# EAGLE design BBB_GenericCape (EAGLE 6.5.0)
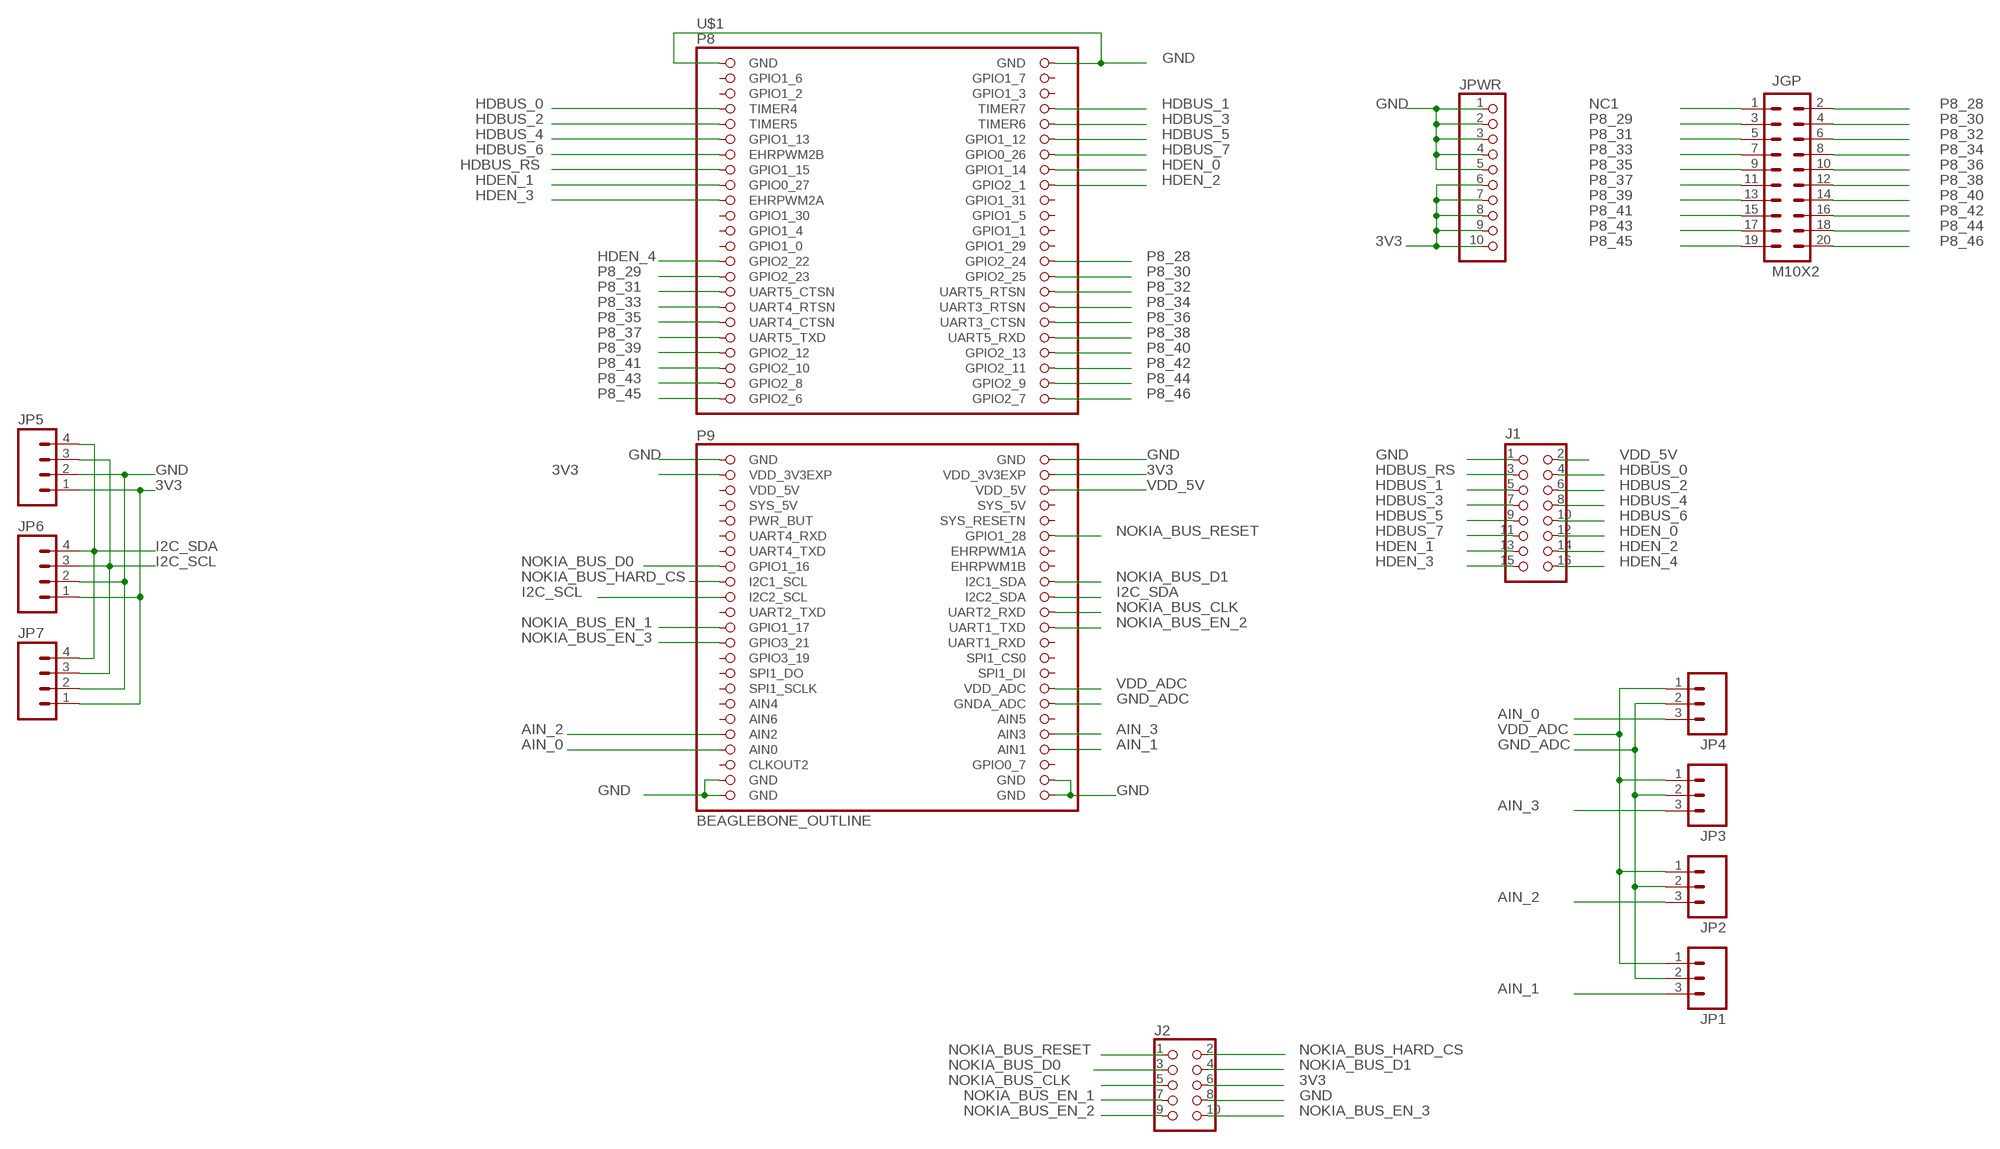
[diagram p0: schematic, sheet 1]

## Parts
J1  CON_HEADER_2X08SHROUDED  [PINSHRD_PTH_2X08]
J2  CON_HEADER_2X05-PTH+SHROUDED_A  [PINSHRD_PTH_2X05]
JGP  M10X2  [2X10]
JP1  M03POLAR  [MOLEX-1X3]
JP2  M03POLAR  [MOLEX-1X3]
JP3  M03POLAR  [MOLEX-1X3]
JP4  M03POLAR  [MOLEX-1X3]
JP5  M04POLAR  [MOLEX-1X4]
JP6  M04POLAR  [MOLEX-1X4]
JP7  M04POLAR  [MOLEX-1X4]
JPWR  PINHD-1X10  [1X10]
U$1  BEAGLEBONE_OUTLINE  [BEAGLEBONE_SHIELD]

## Nets
3V3: J2.6 JP5.1 JP6.1 JP7.1 JPWR.6 JPWR.7 JPWR.8 JPWR.9 JPWR.10 U$1.49(VDD_3V3EXP) U$1.50(VDD_3V3EXP)
AIN_0: JP4.3 U$1.85(AIN0)
AIN_1: JP1.3 U$1.86(AIN1)
AIN_2: JP2.3 U$1.83(AIN2)
AIN_3: JP3.3 U$1.84(AIN3)
GND: J1.1 J2.8 JP5.2 JP6.2 JP7.2 JPWR.1 JPWR.2 JPWR.3 JPWR.4 JPWR.5 U$1.1(GND) U$1.2(GND) U$1.47(GND) U$1.48(GND) U$1.89(GND) U$1.90(GND) U$1.91(GND) U$1.92(GND)
GND_ADC: JP1.2 JP2.2 JP3.2 JP4.2 U$1.80(GNDA_ADC)
HDBUS_0: J1.4 U$1.7(TIMER4)
HDBUS_1: J1.5 U$1.8(TIMER7)
HDBUS_2: J1.6 U$1.9(TIMER5)
HDBUS_3: J1.7 U$1.10(TIMER6)
HDBUS_4: J1.8 U$1.11(GPIO1_13)
HDBUS_5: J1.9 U$1.12(GPIO1_12)
HDBUS_6: J1.10 U$1.13(EHRPWM2B)
HDBUS_7: J1.11 U$1.14(GPIO0_26)
HDBUS_RS: J1.3 U$1.15(GPIO1_15)
HDEN_0: J1.12 U$1.16(GPIO1_14)
HDEN_1: J1.13 U$1.17(GPIO0_27)
HDEN_2: J1.14 U$1.18(GPIO2_1)
HDEN_3: J1.15 U$1.19(EHRPWM2A)
HDEN_4: J1.16 U$1.27(GPIO2_22)
I2C_SCL: JP5.3 JP6.3 JP7.3 U$1.65(I2C2_SCL)
I2C_SDA: JP5.4 JP6.4 JP7.4 U$1.66(I2C2_SDA)
NC1: JGP.1
NOKIA_BUS_CLK: J2.5 U$1.68(UART2_RXD)
NOKIA_BUS_D0: J2.3 U$1.61(GPIO1_16)
NOKIA_BUS_D1: J2.4 U$1.64(I2C1_SDA)
NOKIA_BUS_EN_1: J2.7 U$1.69(GPIO1_17)
NOKIA_BUS_EN_2: J2.9 U$1.70(UART1_TXD)
NOKIA_BUS_EN_3: J2.10 U$1.71(GPIO3_21)
NOKIA_BUS_HARD_CS: J2.2 U$1.63(I2C1_SCL)
NOKIA_BUS_RESET: J2.1 U$1.58(GPIO1_28)
P8_28: JGP.2 U$1.28(GPIO2_24)
P8_29: JGP.3 U$1.29(GPIO2_23)
P8_30: JGP.4 U$1.30(GPIO2_25)
P8_31: JGP.5 U$1.31(UART5_CTSN)
P8_32: JGP.6 U$1.32(UART5_RTSN)
P8_33: JGP.7 U$1.33(UART4_RTSN)
P8_34: JGP.8 U$1.34(UART3_RTSN)
P8_35: JGP.9 U$1.35(UART4_CTSN)
P8_36: JGP.10 U$1.36(UART3_CTSN)
P8_37: JGP.11 U$1.37(UART5_TXD)
P8_38: JGP.12 U$1.38(UART5_RXD)
P8_39: JGP.13 U$1.39(GPIO2_12)
P8_40: JGP.14 U$1.40(GPIO2_13)
P8_41: JGP.15 U$1.41(GPIO2_10)
P8_42: JGP.16 U$1.42(GPIO2_11)
P8_43: JGP.17 U$1.43(GPIO2_8)
P8_44: JGP.18 U$1.44(GPIO2_9)
P8_45: JGP.19 U$1.45(GPIO2_6)
P8_46: JGP.20 U$1.46(GPIO2_7)
VDD_5V: J1.2 U$1.52(VDD_5V)
VDD_ADC: JP1.1 JP2.1 JP3.1 JP4.1 U$1.78(VDD_ADC)
Unconnected: U$1.3(GPIO1_6) U$1.4(GPIO1_7) U$1.5(GPIO1_2) U$1.6(GPIO1_3) U$1.20(GPIO1_31) U$1.21(GPIO1_30) U$1.22(GPIO1_5) U$1.23(GPIO1_4) U$1.24(GPIO1_1) U$1.25(GPIO1_0) U$1.26(GPIO1_29) U$1.54(SYS_5V) U$1.55(PWR_BUT) U$1.56(SYS_RESETN) U$1.57(UART4_RXD) U$1.59(UART4_TXD) U$1.60(EHRPWM1A) U$1.62(EHRPWM1B) U$1.67(UART2_TXD) U$1.72(UART1_RXD) U$1.73(GPIO3_19) U$1.74(SPI1_CS0) U$1.75(SPI1_DO) U$1.76(SPI1_DI) U$1.77(SPI1_SCLK) U$1.79(AIN4) U$1.81(AIN6) U$1.82(AIN5) U$1.87(CLKOUT2) U$1.88(GPIO0_7)

## Power pins joined to a net without a drawn wire
SYS_5V: U$1.53(SYS_5V)
VDD_5V: U$1.51(VDD_5V)

## Library data of the parts
J1 = dp_devices:CON_HEADER_2X08
J2 = dp_devices:CON_HEADER_2X05: 2x05 pin header
JGP = SparkFun-Connectors:M10X2: This was SPECIALLY designed to be used with our Graphic LCD Backpack. Be sure you want to use this! It is not only staggered on each line of header holes, but IT IS ALSO offset of the center point of the top and bottom lines by 5 mil. This causes the headers to lock into place on the "standard" footprint on the LCD screen. The extra squares on the tdocu layer are there simply to reference other pins (if you were to actually populate a longer header than ten long - this is what we do with the backpacks).
JP1-JP4 = SparkFun-Connectors:M03: Header 3 Standard 3-pin 0.1" header. Use with straight break away headers (SKU : PRT-00116), right angle break away headers (PRT-00553), swiss pins (PRT-00743), machine pins (PRT-00117), and female headers (PRT-00115). Molex polarized connector foot print use with SKU : PRT-08232 with associated crimp pins and housings.
JP5-JP7 = SparkFun-Connectors:M04: Header 4 Standard 4-pin 0.1" header. Use with straight break away headers (SKU : PRT-00116), right angle break away headers (PRT-00553), swiss pins (PRT-00743), machine pins (PRT-00117), and female headers (PRT-00115). Molex polarized connector foot print use with SKU : PRT-08231 with associated crimp pins and housings. 1MM SMD Version SKU: PRT-10208
JPWR = pinhead:PINHD-1X10: PIN HEADER
U$1 = adafruit:BEAGLEBONE_OUTLINE: Should match A3 pinout - but not completely tested

## Board
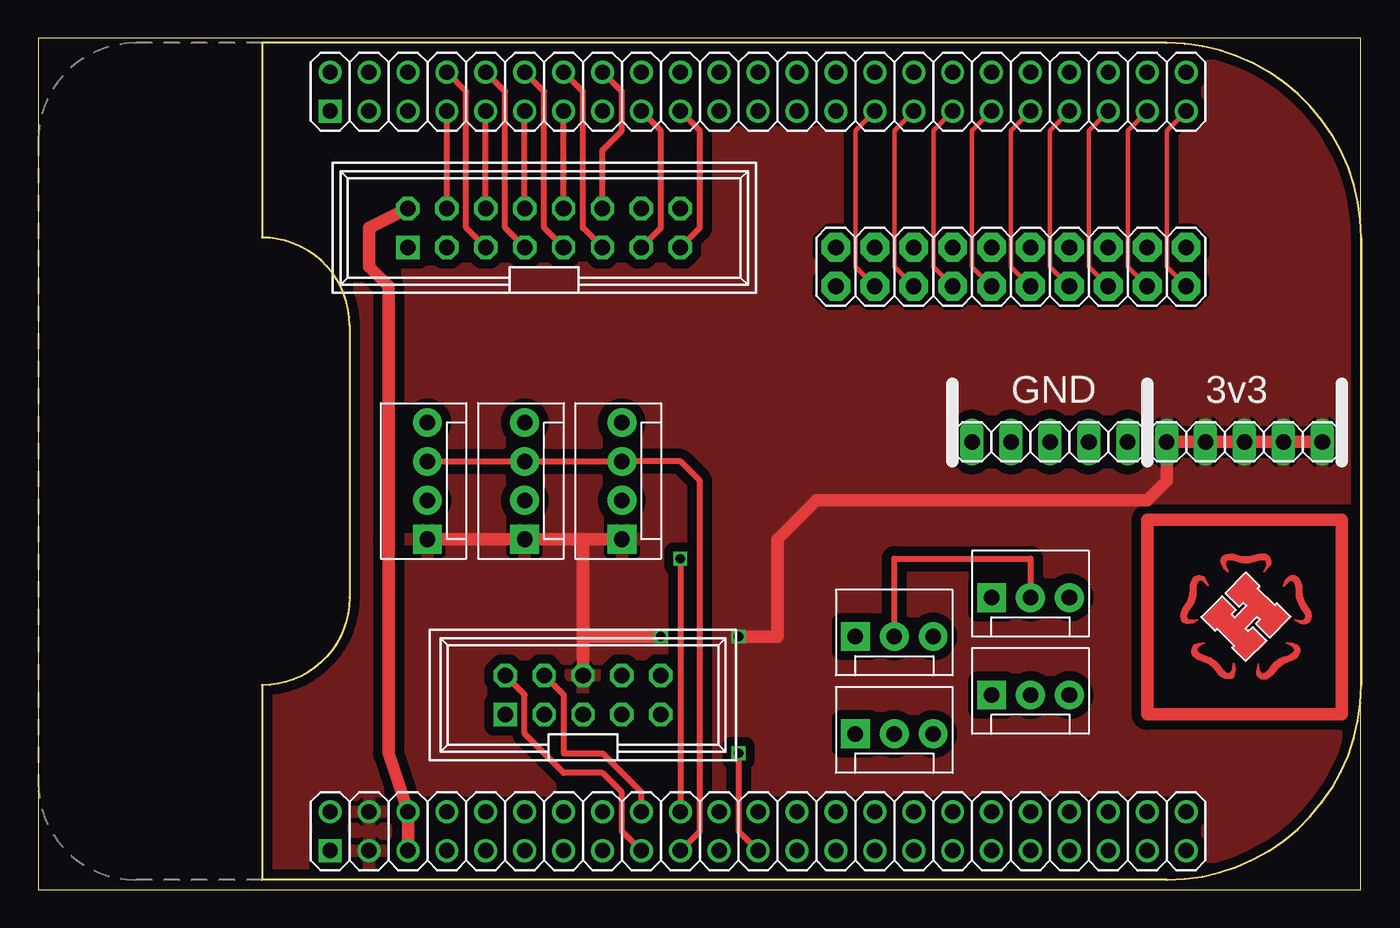
[diagram p1: board, top side]
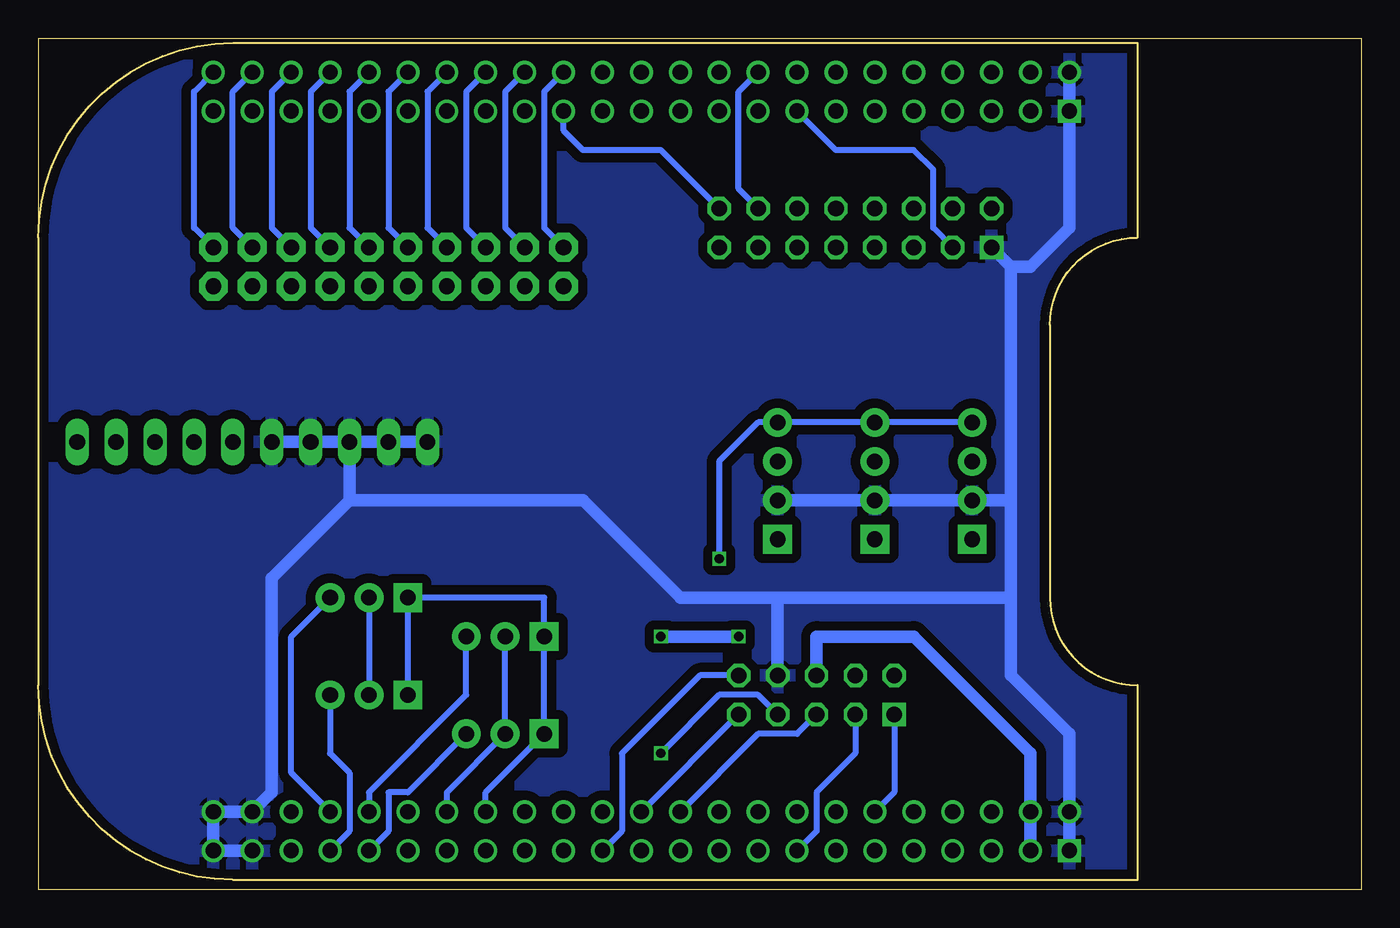
[diagram p2: board, bottom side, seen from below]

Size 86.36 x 55.55 mm. Coordinates in mm from the lower left corner, seen from the top.
Outline: 0,0 86.34,0 86.34,55.55 0,55.55 0,0
Copper layers (1*2*15*16): Top 0.035mm / dielectric 0.2mm / Route2 0.0175mm / dielectric 1.1mm / Route15 0.0175mm / dielectric 0.2mm / Bottom 0.035mm
Design rules "SeeedStudio_DRU_no_angle_20130527": minimum track width 6mil, minimum drill 12mil, track to track 6mil, track to pad 6mil, pad to pad 6mil, via to via 6mil, smd to smd 0mil, copper to edge 10mil, drill to drill 10mil, minimum pad ring 6mil, minimum via ring 6mil, stop-mask expansion 2mil, vias tented up to drill 25mil, thermal gap 10mil

### Footprints (pad centres in the part's own frame; a part is rotated, then mirrored left to right if it is on the bottom)
PINSHRD_PTH_2X08 = drill 1.016 square: 1 -7.62,-1.27 | drill 1.016 octagon: 2 -7.62,1.27; 3 -5.08,-1.27; 4 -5.08,1.27; 5 -2.54,-1.27; 6 -2.54,1.27; 7 0,-1.27; 8 0,1.27; 9 2.54,-1.27; 10 2.54,1.27; 11 5.08,-1.27; 12 5.08,1.27; 13 7.62,-1.27; 14 7.62,1.27; 15 10.16,-1.27; 16 10.16,1.27
PINSHRD_PTH_2X05 = drill 1.016 square: 1 -5.08,-1.27 | drill 1.016 octagon: 2 -5.08,1.27; 3 -2.54,-1.27; 4 -2.54,1.27; 5 0,-1.27; 6 0,1.27; 7 2.54,-1.27; 8 2.54,1.27; 9 5.08,-1.27; 10 5.08,1.27
2X10 = drill 1.016 pad 1.88 octagon: 1 -11.43,-1.27; 2 -11.43,1.27; 3 -8.89,-1.27; 4 -8.89,1.27; 5 -6.35,-1.27; 6 -6.35,1.27; 7 -3.81,-1.27; 8 -3.81,1.27; 9 -1.27,-1.27; 10 -1.27,1.27; 11 1.27,-1.27; 12 1.27,1.27; 13 3.81,-1.27; 14 3.81,1.27; 15 6.35,-1.27; 16 6.35,1.27; 17 8.89,-1.27; 18 8.89,1.27; 19 11.43,-1.27; 20 11.43,1.27
MOLEX-1X3 = drill 1.016 pad 1.88 square: 1 0,0 | drill 1.016 pad 1.88: 2 2.54,0; 3 5.08,0
MOLEX-1X4 = drill 1.016 pad 1.88 square: 1 0,0 | drill 1.016 pad 1.88: 2 2.54,0; 3 5.08,0; 4 7.62,0
1X10 = drill 1.016 long: 1 -11.43,0; 2 -8.89,0; 3 -6.35,0; 4 -3.81,0; 5 -1.27,0; 6 1.27,0; 7 3.81,0; 8 6.35,0; 9 8.89,0; 10 11.43,0
BEAGLEBONE_SHIELD = drill 1 square: 1 4.445,19.05; 47 52.705,19.05 | drill 1: 2 1.905,19.05; 3 4.445,21.59; 4 1.905,21.59; 5 4.445,24.13; 6 1.905,24.13; 7 4.445,26.67; 8 1.905,26.67; 9 4.445,29.21; 10 1.905,29.21; 11 4.445,31.75; 12 1.905,31.75; 13 4.445,34.29; 14 1.905,34.29; 15 4.445,36.83; 16 1.905,36.83; 17 4.445,39.37; 18 1.905,39.37; 19 4.445,41.91; 20 1.905,41.91; 21 4.445,44.45; 22 1.905,44.45; 23 4.445,46.99; 24 1.905,46.99; 25 4.445,49.53; 26 1.905,49.53; 27 4.445,52.07; 28 1.905,52.07; 29 4.445,54.61; 30 1.905,54.61; 31 4.445,57.15; 32 1.905,57.15; 33 4.445,59.69; 34 1.905,59.69; 35 4.445,62.23; 36 1.905,62.23; 37 4.445,64.77; 38 1.905,64.77; 39 4.445,67.31; 40 1.905,67.31; 41 4.445,69.85; 42 1.905,69.85; 43 4.445,72.39; 44 1.905,72.39; 45 4.445,74.93; 46 1.905,74.93; 48 50.165,19.05; 49 52.705,21.59; 50 50.165,21.59; 51 52.705,24.13; 52 50.165,24.13; 53 52.705,26.67; 54 50.165,26.67; 55 52.705,29.21; 56 50.165,29.21; 57 52.705,31.75; 58 50.165,31.75; 59 52.705,34.29; 60 50.165,34.29; 61 52.705,36.83; 62 50.165,36.83; 63 52.705,39.37; 64 50.165,39.37; 65 52.705,41.91; 66 50.165,41.91; 67 52.705,44.45; 68 50.165,44.45; 69 52.705,46.99; 70 50.165,46.99; 71 52.705,49.53; 72 50.165,49.53; 73 52.705,52.07; 74 50.165,52.07; 75 52.705,54.61; 76 50.165,54.61; 77 52.705,57.15; 78 50.165,57.15; 79 52.705,59.69; 80 50.165,59.69; 81 52.705,62.23; 82 50.165,62.23; 83 52.705,64.77; 84 50.165,64.77; 85 52.705,67.31; 86 50.165,67.31; 87 52.705,69.85; 88 50.165,69.85; 89 52.705,72.39; 90 50.165,72.39; 91 52.705,74.93; 92 50.165,74.93

### Placement (x,y rotation side)
J1  31.75,43.18 0 top
J2  35.56,12.7 0 top
JGP  63.5,40.64 0 top
JP1  62.23,19.05 0 top
JP2  53.34,10.16 0 top
JP3  53.34,16.51 0 top
JP4  62.23,12.7 0 top
JP5  38.1,22.86 90 top
JP6  31.75,22.86 90 top
JP7  25.4,22.86 90 top
JPWR  72.39,29.21 0 top
U$1  0,55.24 270 top
U$4  [YHSLOGO_SMALL_FANCY]  78.74,17.78 0 top

### Tracks (layer width: path | path; a pad name or v marks a point on that pad's centre or on a via)
3V3  (via drill 0.6)
  Top 0.813: JPWR.10 JPWR.9 JPWR.8 JPWR.7 JPWR.6 73.66,26.67 72.39,25.4 50.8,25.4 48.26,22.86 48.26,16.51 v45.72,16.51 | v40.64,16.51 35.56,16.51 | 35.56,16.51 J2.6 | JP7.1 JP6.1 JP5.1 35.56,22.86 35.56,16.51
  Bottom 0.813: J2.6 35.56,16.51 29.21,16.51 21.59,8.89 U$1.50 U$1.49 | v45.72,16.51 v40.64,16.51
  pour Top (isolate 0.61): 15.24,0 86.36,0 86.36,54.61 86.36,55.88 13.97,55.88 13.97,0
AIN_0
  Bottom 0.406: JP4.3 67.31,8.89 66.04,7.62 66.04,3.81 U$1.85
AIN_1
  Bottom 0.406: JP1.3 69.85,16.51 69.85,7.62 U$1.86
AIN_2
  Bottom 0.406: JP2.3 62.23,6.35 63.5,6.35 63.5,3.81 U$1.83
AIN_3
  Bottom 0.406: JP3.3 58.42,12.7 64.77,6.35 U$1.84
GND
  Bottom 0.813: 22.86,19.05 22.86,13.97 19.05,10.16 U$1.48 U$1.47 | 22.86,19.05 22.86,25.4 | 22.86,25.4 22.86,40.64 | U$1.2 U$1.1 19.05,43.18 21.59,40.64 22.86,40.64 | 38.1,19.05 22.86,19.05 | JP5.2 JP6.2 JP7.2 22.86,25.4 | 38.1,19.05 J2.8 | J1.1 22.86,40.64 | U$1.89 U$1.91 U$1.92 U$1.90 71.12,6.35 71.12,20.32 66.04,25.4 | 66.04,25.4 50.8,25.4 44.45,19.05 38.1,19.05 | JPWR.1 JPWR.2 JPWR.3 | JPWR.3 JPWR.4 JPWR.5 | JPWR.3 66.04,25.4
  pour Bottom (isolate 0.61): 13.97,0 86.36,0 86.36,55.88 13.97,55.88
GND_ADC
  Top 0.406: JP3.2 55.88,21.59 64.77,21.59 JP1.2
  Bottom 0.406: JP3.2 JP2.2 59.69,6.35 U$1.80 | JP1.2 JP4.2
HDBUS_0
  Top 0.406: J1.4 U$1.7
HDBUS_1
  Top 0.406: J1.5 27.94,43.18 27.94,52.07 U$1.8
HDBUS_2
  Top 0.406: J1.6 U$1.9
HDBUS_3
  Top 0.406: J1.7 30.48,43.18 30.48,52.07 U$1.10
HDBUS_4
  Top 0.406: J1.8 U$1.11
HDBUS_5
  Top 0.406: J1.9 33.02,43.18 33.02,52.07 U$1.12
HDBUS_6
  Top 0.406: J1.10 U$1.13
HDBUS_7
  Top 0.406: J1.11 35.56,43.18 35.56,52.07 U$1.14
HDBUS_RS
  Bottom 0.406: J1.3 27.94,43.18 27.94,46.99 29.21,48.26 34.29,48.26 U$1.15
HDEN_0
  Top 0.406: J1.12 36.83,48.26 38.1,49.53 38.1,52.07 U$1.16
HDEN_1
  Top 0.406: J1.13 40.64,43.18 40.64,49.53 U$1.17
HDEN_2
  Bottom 0.406: J1.14 40.64,45.72 40.64,52.07 U$1.18
HDEN_3
  Top 0.406: J1.15 43.18,43.18 43.18,49.53 U$1.19
HDEN_4
  Bottom 0.406: J1.16 45.72,48.26 50.8,48.26 52.07,49.53 U$1.27
I2C_SCL
  Top 0.406: JP7.3 JP6.3 JP5.3 41.91,27.94 43.18,26.67 43.18,3.81 U$1.65
I2C_SDA  (via drill 0.6)
  Top 0.406: v41.91,21.59 U$1.66
  Bottom 0.406: JP7.4 JP6.4 JP5.4 39.37,30.48 41.91,27.94 v41.91,21.59
LOGO_GUARD_3V3
  Top 0.813: 72.39,24.13 85.09,24.13 85.09,11.43 72.39,11.43 72.39,24.13
NOKIA_BUS_CLK
  Bottom 0.406: U$1.68 39.37,10.16 36.83,10.16 J2.5
NOKIA_BUS_D0
  Bottom 0.406: J2.3 33.02,8.89 35.56,6.35 35.56,3.81 U$1.61
NOKIA_BUS_D1
  Top 0.406: J2.4 34.29,12.7 34.29,8.89 36.83,8.89 39.37,6.35 U$1.64
NOKIA_BUS_EN_1  (via drill 0.6)
  Top 0.406: v45.72,8.89 45.72,3.81 U$1.69
  Bottom 0.406: J2.7 39.37,12.7 41.91,12.7 v45.72,8.89
NOKIA_BUS_EN_2
  Bottom 0.406: U$1.70 J2.9
NOKIA_BUS_EN_3
  Bottom 0.406: J2.10 43.18,13.97 48.26,8.89 48.26,3.81 U$1.71
NOKIA_BUS_HARD_CS
  Top 0.406: J2.2 31.75,12.7 31.75,10.16 34.29,7.62 36.83,7.62 38.1,6.35 38.1,3.81 U$1.63
NOKIA_BUS_RESET
  Bottom 0.406: J2.1 30.48,6.35 U$1.58
P8_28
  Bottom 0.406: U$1.28 53.34,52.07 53.34,43.18 JGP.2
P8_29
  Top 0.305: JGP.3 53.34,40.64 53.34,49.53 U$1.29
P8_30
  Bottom 0.406: U$1.30 55.88,52.07 55.88,43.18 JGP.4
P8_31
  Top 0.305: JGP.5 55.88,40.64 55.88,49.53 U$1.31
P8_32
  Bottom 0.406: U$1.32 58.42,52.07 58.42,43.18 JGP.6
P8_33
  Top 0.305: JGP.7 58.42,40.64 58.42,49.53 U$1.33
P8_34
  Bottom 0.406: U$1.34 60.96,52.07 60.96,43.18 JGP.8
P8_35
  Top 0.305: JGP.9 60.96,40.64 60.96,49.53 U$1.35
P8_36
  Bottom 0.406: U$1.36 63.5,52.07 63.5,43.18 JGP.10
P8_37
  Top 0.305: JGP.11 63.5,40.64 63.5,49.53 U$1.37
P8_38
  Bottom 0.406: U$1.38 66.04,52.07 66.04,43.18 JGP.12
P8_39
  Top 0.305: JGP.13 66.04,40.64 66.04,49.53 U$1.39
P8_40
  Bottom 0.406: U$1.40 68.58,52.07 68.58,43.18 JGP.14
P8_41
  Top 0.305: JGP.15 68.58,40.64 68.58,49.53 U$1.41
P8_42
  Bottom 0.406: U$1.42 71.12,52.07 71.12,43.18 JGP.16
P8_43
  Top 0.305: JGP.17 71.12,40.64 71.12,49.53 U$1.43
P8_44
  Bottom 0.406: JGP.18 73.66,43.18 73.66,52.07 U$1.44
P8_45
  Top 0.305: JGP.19 73.66,40.64 73.66,49.53 U$1.45
P8_46
  Bottom 0.406: JGP.20 76.2,43.18 76.2,52.07 U$1.46
VDD_5V
  Top 0.813: U$1.51 U$1.52 22.86,8.89 22.86,22.86 22.86,39.37 21.59,40.64 21.59,43.18 J1.2
VDD_ADC
  Bottom 0.406: JP4.1 JP1.1 53.34,19.05 JP3.1 JP2.1 57.15,6.35 U$1.78

### Text on the board
tPlace: GND | 3v3
tValues: 28 / 30 / 32 / 34 / 36 / 38 / 40 / 42 / 44 / 46 | HD44780 Bus | N/C / 29 / 31 / 33 / 35 / 37 / 39 / 41 / 43 / 45 | P8 GPIOs | I2C | SDA | SCL | ADCs | GND | IN_1 | VCC | VCC | GND | AIN | Nokia Bus | IN_3 | IN_0 | IN_2